# EAGLE design MainBoard (EAGLE 9.6.2)
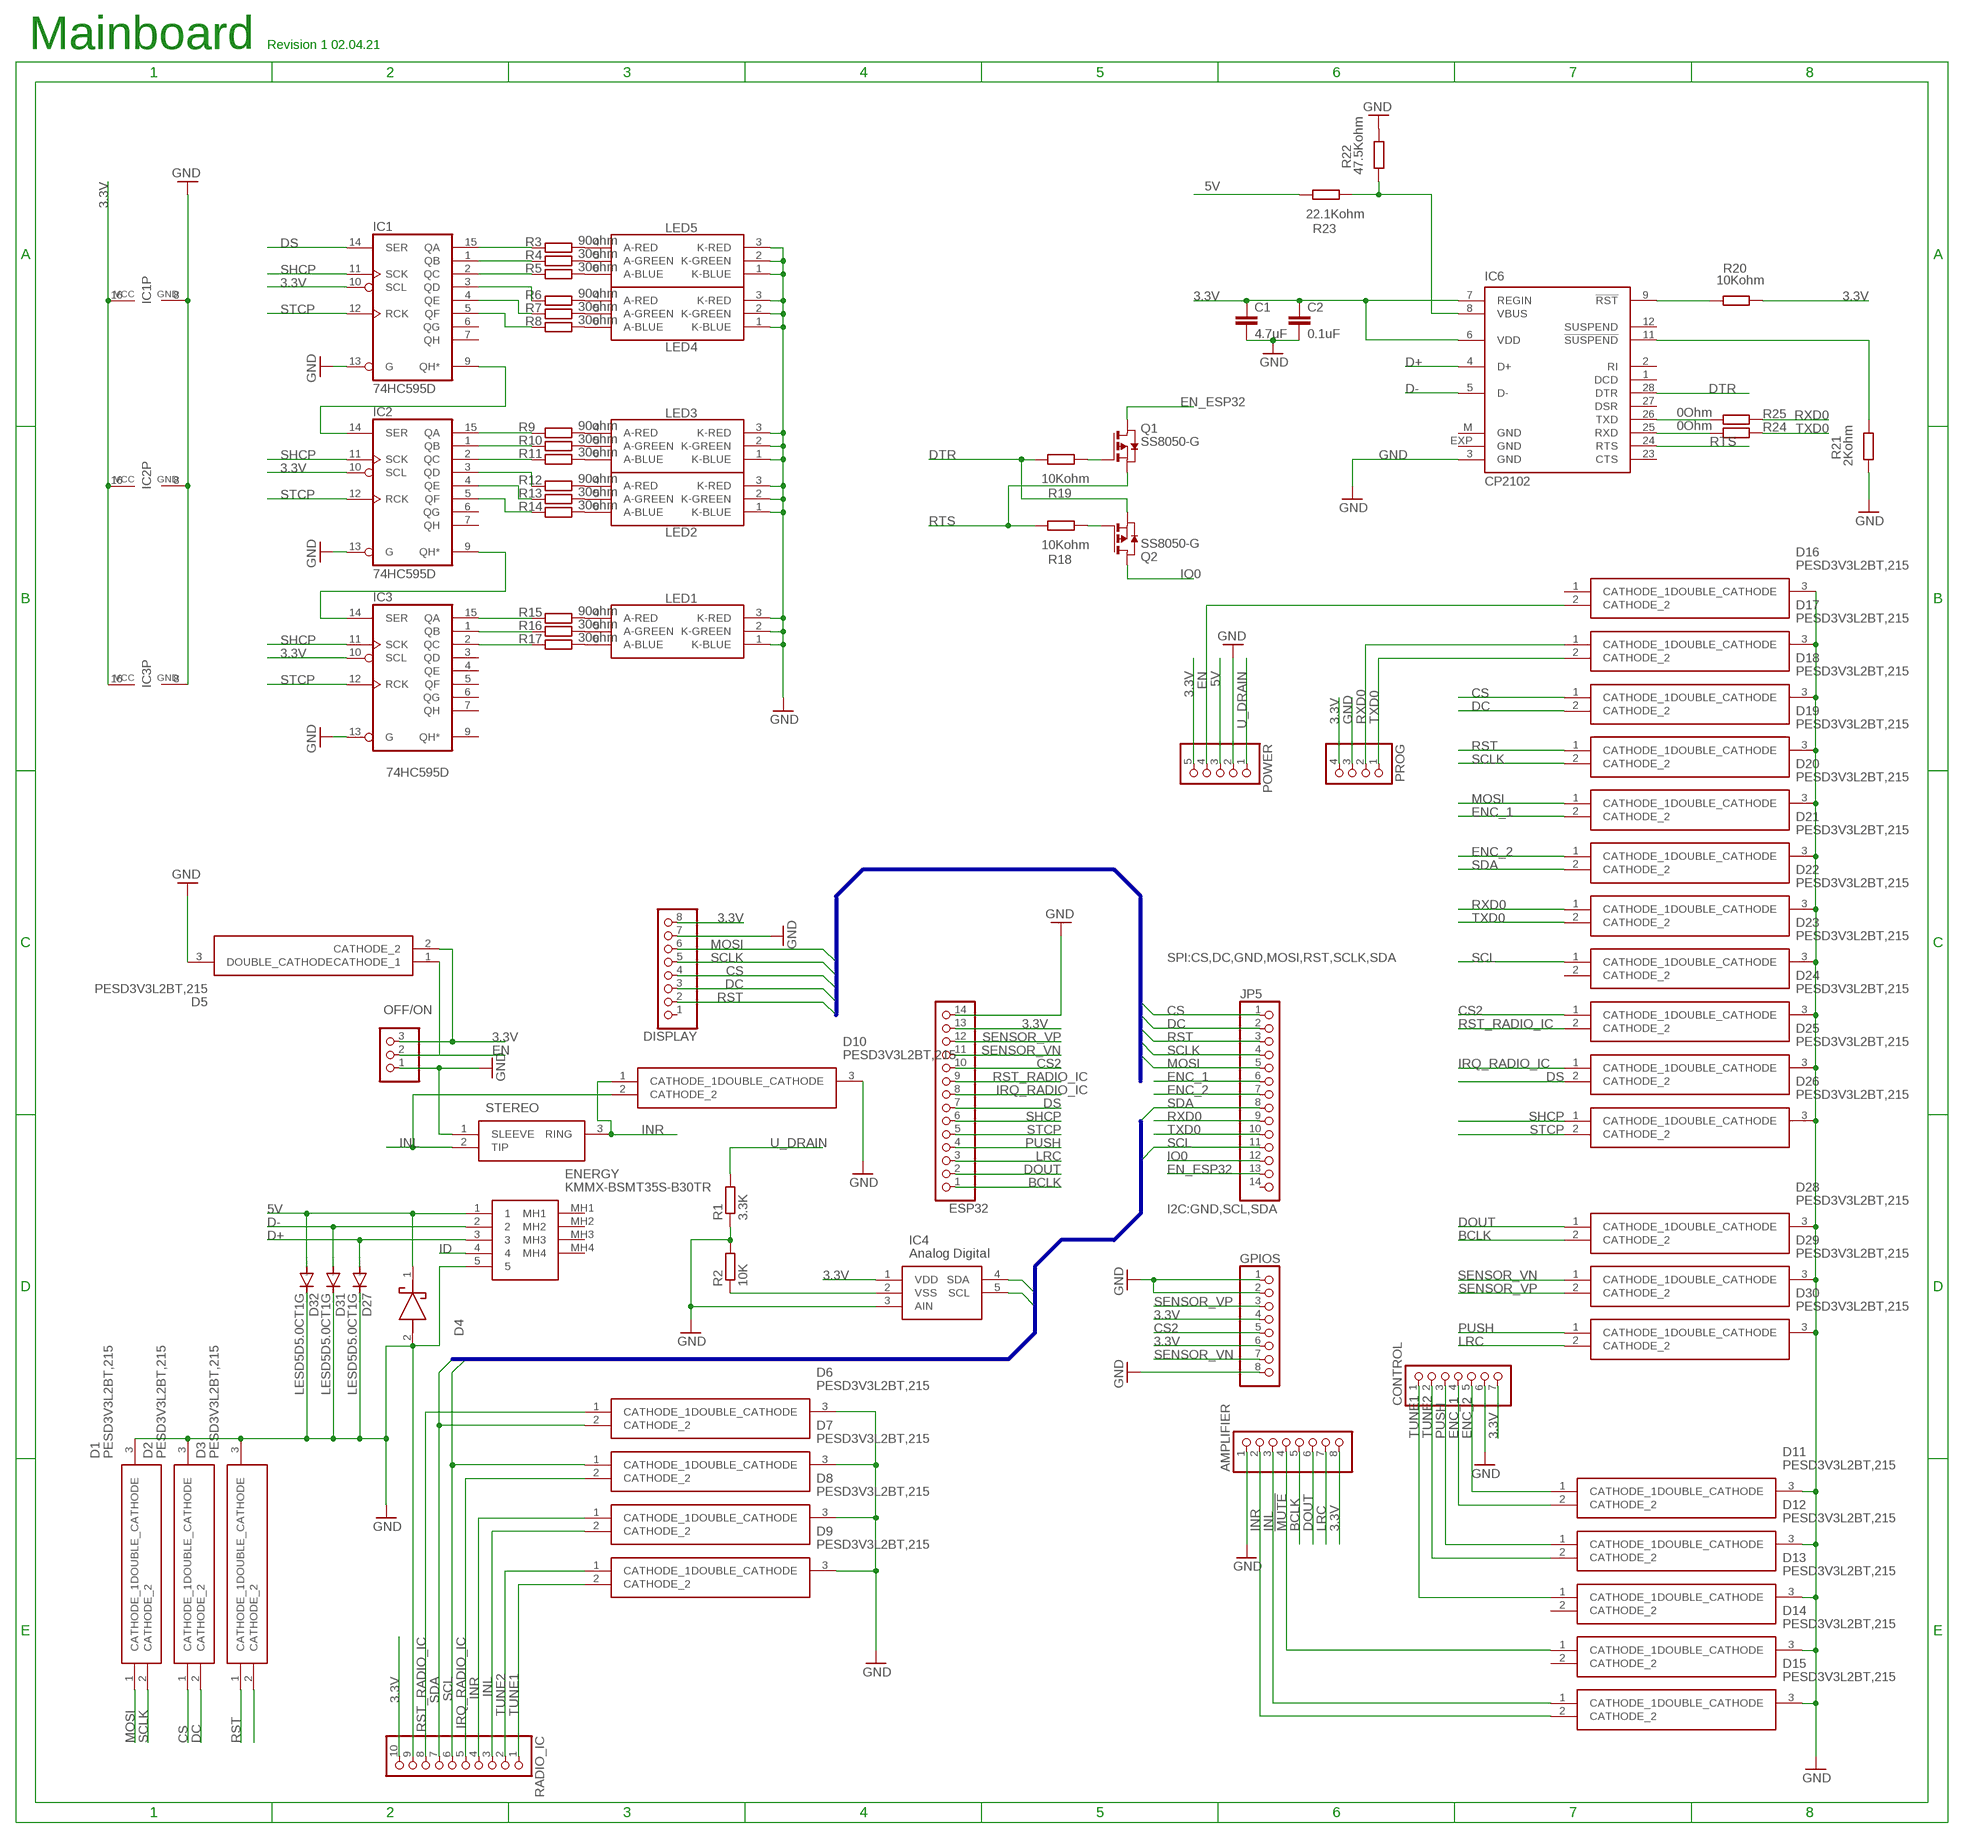
[diagram p0: schematic, sheet 1]

## Parts
AMPLIFIER  PINHD-1X8  [1X08]
C1  4.7uF  C-EUC0805  [C0805]
C2  0.1uF  C-EUC0805  [C0805]
CONTROL  PINHD-1X7  [1X07]
D1  PESD3V3L2BT,215  [SOT95P230X110-3N]
D2  PESD3V3L2BT,215  [SOT95P230X110-3N]
D3  PESD3V3L2BT,215  [SOT95P230X110-3N]
D4  LSM115JE3_TR13  [DIOM5436X330N]
D5  PESD3V3L2BT,215  [SOT95P230X110-3N]
D6  PESD3V3L2BT,215  [SOT95P230X110-3N]
D7  PESD3V3L2BT,215  [SOT95P230X110-3N]
D8  PESD3V3L2BT,215  [SOT95P230X110-3N]
D9  PESD3V3L2BT,215  [SOT95P230X110-3N]
D10  PESD3V3L2BT,215  [SOT95P230X110-3N]
D11  PESD3V3L2BT,215  [SOT95P230X110-3N]
D12  PESD3V3L2BT,215  [SOT95P230X110-3N]
D13  PESD3V3L2BT,215  [SOT95P230X110-3N]
D14  PESD3V3L2BT,215  [SOT95P230X110-3N]
D15  PESD3V3L2BT,215  [SOT95P230X110-3N]
D16  PESD3V3L2BT,215  [SOT95P230X110-3N]
D17  PESD3V3L2BT,215  [SOT95P230X110-3N]
D18  PESD3V3L2BT,215  [SOT95P230X110-3N]
D19  PESD3V3L2BT,215  [SOT95P230X110-3N]
D20  PESD3V3L2BT,215  [SOT95P230X110-3N]
D21  PESD3V3L2BT,215  [SOT95P230X110-3N]
D22  PESD3V3L2BT,215  [SOT95P230X110-3N]
D23  PESD3V3L2BT,215  [SOT95P230X110-3N]
D24  PESD3V3L2BT,215  [SOT95P230X110-3N]
D25  PESD3V3L2BT,215  [SOT95P230X110-3N]
D26  PESD3V3L2BT,215  [SOT95P230X110-3N]
D27  LESD5D5.0CT1G  DIODE-SOD523  [SOD523]
D28  PESD3V3L2BT,215  [SOT95P230X110-3N]
D29  PESD3V3L2BT,215  [SOT95P230X110-3N]
D30  PESD3V3L2BT,215  [SOT95P230X110-3N]
D31  LESD5D5.0CT1G  DIODE-SOD523  [SOD523]
D32  LESD5D5.0CT1G  DIODE-SOD523  [SOD523]
DISPLAY  PINHD-1X8  [1X08]
ENERGY  KMMX-BSMT35S-B30TR  [KMMXBSMT35SB30TR]
ESP32  PINHD-1X14  [1X14]
GPIOS  PINHD-1X8  [1X08]
IC1  74HC595D  [SO16]
IC2  74HC595D  [SO16]
IC3  74HC595D  [SO16]
IC4  Analog Digital  MCP3221A6T-E_OTVAO  [SOT95P280X145-5N]
IC6  CP2102  [MLP28]
JP5  PINHD-1X14  [1X14]
LED1  CLY6D-FKC-CK1N1D1BB7D3D3  [PLCC6]
LED2  CLY6D-FKC-CK1N1D1BB7D3D3  [PLCC6]
LED3  CLY6D-FKC-CK1N1D1BB7D3D3  [PLCC6]
LED4  CLY6D-FKC-CK1N1D1BB7D3D3  [PLCC6]
LED5  CLY6D-FKC-CK1N1D1BB7D3D3  [PLCC6]
OFF/ON  PINHD-1X3  [1X03]
POWER  PINHD-1X5  [1X05]
PROG  PINHD-1X4  [1X04]
Q1  SS8050-G  PMOSSOT23  [SOT-23]
Q2  SS8050-G  PMOSSOT23  [SOT-23]
R1  3.3K  R-EU_R0603  [R0603]
R2  10K  R-EU_R0603  [R0603]
R3  90ohm  R-EU_R0402  [R0402]
R4  30ohm  R-EU_R0402  [R0402]
R5  30ohm  R-EU_R0402  [R0402]
R6  90ohm  R-EU_R0402  [R0402]
R7  30ohm  R-EU_R0402  [R0402]
R8  30ohm  R-EU_R0402  [R0402]
R9  90ohm  R-EU_R0402  [R0402]
R10  30ohm  R-EU_R0402  [R0402]
R11  30ohm  R-EU_R0402  [R0402]
R12  90ohm  R-EU_R0402  [R0402]
R13  30ohm  R-EU_R0402  [R0402]
R14  30ohm  R-EU_R0402  [R0402]
R15  90ohm  R-EU_R0402  [R0402]
R16  30ohm  R-EU_R0402  [R0402]
R17  30ohm  R-EU_R0402  [R0402]
R18  10Kohm  R-EU_R0402  [R0402]
R19  10Kohm  R-EU_R0402  [R0402]
R20  10Kohm  R-EU_R0402  [R0402]
R21  2Kohm  R-EU_R0805  [R0805]
R22  47.5Kohm  R-EU_R0402  [R0402]
R23  22.1Kohm  R-EU_R0402  [R0402]
R24  0Ohm  R-EU_R0603  [R0603]
R25  0Ohm  R-EU_R0603  [R0603]
RADIO_IC  PINHD-1X10  [1X10]
STEREO  SJ-3523-SMT-TR  [SJ3523SMTTR]

## Nets
3.3V: AMPLIFIER.8 C1.1 C2.1 CONTROL.7 D5.2(CATHODE_2) DISPLAY.8 ESP32.13 GPIOS.4 GPIOS.6 IC1.10(SCL) IC1.16(VCC) IC2.10(SCL) IC2.16(VCC) IC3.10(SCL) IC3.16(VCC) IC4.1(VDD) IC6.6(VDD) IC6.7(REGIN) OFF/ON.3 POWER.5 PROG.4 R20.2 RADIO_IC.10
5V: D4.1(K) D32.A ENERGY.1 POWER.3 R23.1
!MUTE: AMPLIFIER.4 D14.1(CATHODE_1)
BCLK: AMPLIFIER.5 D28.2(CATHODE_2) ESP32.1
CS: D2.1(CATHODE_1) D18.1(CATHODE_1) DISPLAY.4 JP5.1
CS2: D24.1(CATHODE_1) ESP32.10 GPIOS.5
D+: D27.A ENERGY.3 IC6.4(D+)
D-: D31.A ENERGY.2 IC6.5(D-)
DC: D2.2(CATHODE_2) D18.2(CATHODE_2) DISPLAY.3 JP5.2
DOUT: AMPLIFIER.6 D28.1(CATHODE_1) ESP32.2
DS: D25.2(CATHODE_2) ESP32.7 IC1.14(SER)
DTR: IC6.28(DTR) Q2.2(S) R19.1
EN: D5.1(CATHODE_1) D16.2(CATHODE_2) OFF/ON.2 POWER.4
EN_ESP32: JP5.13 Q1.1(D)
ENC_1: CONTROL.4 D11.2(CATHODE_2) D20.2(CATHODE_2) JP5.6
ENC_2: CONTROL.5 D11.1(CATHODE_1) D21.1(CATHODE_1) JP5.7
GND: AMPLIFIER.1 C1.2 C2.2 CONTROL.6 D1.3(DOUBLE_CATHODE) D2.3(DOUBLE_CATHODE) D3.3(DOUBLE_CATHODE) D4.2(A) D5.3(DOUBLE_CATHODE) D6.3(DOUBLE_CATHODE) D7.3(DOUBLE_CATHODE) D8.3(DOUBLE_CATHODE) D9.3(DOUBLE_CATHODE) D10.3(DOUBLE_CATHODE) D11.3(DOUBLE_CATHODE) D12.3(DOUBLE_CATHODE) D13.3(DOUBLE_CATHODE) D14.3(DOUBLE_CATHODE) D15.3(DOUBLE_CATHODE) D16.3(DOUBLE_CATHODE) D17.3(DOUBLE_CATHODE) D18.3(DOUBLE_CATHODE) D19.3(DOUBLE_CATHODE) D20.3(DOUBLE_CATHODE) D21.3(DOUBLE_CATHODE) D22.3(DOUBLE_CATHODE) D23.3(DOUBLE_CATHODE) D24.3(DOUBLE_CATHODE) D25.3(DOUBLE_CATHODE) D26.3(DOUBLE_CATHODE) D27.C D28.3(DOUBLE_CATHODE) D29.3(DOUBLE_CATHODE) D30.3(DOUBLE_CATHODE) D31.C D32.C DISPLAY.7 ENERGY.5 ESP32.14 GPIOS.1 GPIOS.2 GPIOS.8 IC1.8(GND) IC1.13(G) IC2.8(GND) IC2.13(G) IC3.8(GND) IC3.13(G) IC4.3(AIN) IC6.3(GND) LED1.1(K-BLUE) LED1.2(K-GREEN) LED1.3(K-RED) LED2.1(K-BLUE) LED2.2(K-GREEN) LED2.3(K-RED) LED3.1(K-BLUE) LED3.2(K-GREEN) LED3.3(K-RED) LED4.1(K-BLUE) LED4.2(K-GREEN) LED4.3(K-RED) LED5.1(K-BLUE) LED5.2(K-GREEN) LED5.3(K-RED) OFF/ON.1 POWER.2 PROG.3 R1.1 R2.2 R21.1 R22.2 RADIO_IC.9 STEREO.1(SLEEVE)
ID: ENERGY.4
INL: AMPLIFIER.3 D8.2(CATHODE_2) D10.2(CATHODE_2) D15.1(CATHODE_1) RADIO_IC.3 STEREO.2(TIP)
INR: AMPLIFIER.2 D8.1(CATHODE_1) D10.1(CATHODE_1) D15.2(CATHODE_2) RADIO_IC.4 STEREO.3(RING)
IO0: JP5.12 Q2.1(D)
IRQ_RADIO_IC: D7.2(CATHODE_2) D25.1(CATHODE_1) ESP32.8 RADIO_IC.5
LRC: AMPLIFIER.7 D30.2(CATHODE_2) ESP32.3
MOSI: D1.1(CATHODE_1) D20.1(CATHODE_1) DISPLAY.6 JP5.5
N$1: Q2.3(G) R18.2
N$2: Q1.3(G) R19.2
N$3: LED2.4(A-RED) R12.2
N$4: LED1.4(A-RED) R15.2
N$5: D3.2(CATHODE_2)
N$6: LED2.5(A-GREEN) R13.2
N$7: LED5.4(A-RED) R3.2
N$8: LED5.5(A-GREEN) R4.2
N$9: LED5.6(A-BLUE) R5.2
N$10: LED4.4(A-RED) R6.2
N$11: LED4.5(A-GREEN) R7.2
N$12: LED4.6(A-BLUE) R8.2
N$13: LED2.6(A-BLUE) R14.2
N$14: LED3.4(A-RED) R9.2
N$15: LED3.5(A-GREEN) R10.2
N$16: LED3.6(A-BLUE) R11.2
N$17: IC1.9(QH*) IC2.14(SER)
N$18: LED1.5(A-GREEN) R16.2
N$19: LED1.6(A-BLUE) R17.2
N$20: IC3.2(QC) R17.1
N$21: IC2.9(QH*) IC3.14(SER)
N$22: IC4.2(VSS) R2.1
N$23: IC3.1(QB) R16.1
N$24: IC3.15(QA) R15.1
N$25: IC2.3(QD) R12.1
N$26: IC2.4(QE) R13.1
N$27: IC2.5(QF) R14.1
N$28: IC2.2(QC) R11.1
N$29: IC2.1(QB) R10.1
N$30: IC2.15(QA) R9.1
N$31: IC1.15(QA) R3.1
N$32: IC1.1(QB) R4.1
N$33: IC1.2(QC) R5.1
N$34: IC1.3(QD) R6.1
N$35: IC1.4(QE) R7.1
N$36: IC1.5(QF) R8.1
N$38: IC6.9(!RST) R20.1
N$43: IC6.11(!SUSPEND) R21.2
N$44: IC6.8(VBUS) R22.1 R23.2
N$45 [other]: IC6.26(TXD) R24.1
N$46 [other]: IC6.25(RXD) R25.1
PUSH: CONTROL.3 D12.1(CATHODE_1) D30.1(CATHODE_1) ESP32.4
RST: D3.1(CATHODE_1) D19.1(CATHODE_1) DISPLAY.2 JP5.3
RST_RADIO_IC: D6.1(CATHODE_1) D24.2(CATHODE_2) ESP32.9 RADIO_IC.8
RTS: IC6.24(RTS) Q1.2(S) R18.1
RXD0 [other]: D17.1(CATHODE_1) D22.1(CATHODE_1) JP5.9 PROG.2 R24.2
SCL: D7.1(CATHODE_1) D23.1(CATHODE_1) IC4.5(SCL) JP5.11 RADIO_IC.6
SCLK: D1.2(CATHODE_2) D19.2(CATHODE_2) DISPLAY.5 JP5.4
SDA: D6.2(CATHODE_2) D21.2(CATHODE_2) IC4.4(SDA) JP5.8 RADIO_IC.7
SENSOR_VN: D29.1(CATHODE_1) ESP32.11 GPIOS.7
SENSOR_VP: D29.2(CATHODE_2) ESP32.12 GPIOS.3
SHCP: D26.1(CATHODE_1) ESP32.6 IC1.11(SCK) IC2.11(SCK) IC3.11(SCK)
STCP: D26.2(CATHODE_2) ESP32.5 IC1.12(RCK) IC2.12(RCK) IC3.12(RCK)
TUNE1: CONTROL.1 D9.2(CATHODE_2) D13.1(CATHODE_1) RADIO_IC.1
TUNE2: CONTROL.2 D9.1(CATHODE_1) D12.2(CATHODE_2) RADIO_IC.2
TXD0 [other]: D17.2(CATHODE_2) D22.2(CATHODE_2) JP5.10 PROG.1 R25.2
U_DRAIN: POWER.1 R1.2
Unconnected: D13.2(CATHODE_2) D14.2(CATHODE_2) D16.1(CATHODE_1) D23.2(CATHODE_2) DISPLAY.1 ENERGY.MH1 ENERGY.MH2 ENERGY.MH3 ENERGY.MH4 IC1.6(QG) IC1.7(QH) IC2.6(QG) IC2.7(QH) IC3.3(QD) IC3.4(QE) IC3.5(QF) IC3.6(QG) IC3.7(QH) IC3.9(QH*) IC6.1(DCD) IC6.2(RI) IC6.12(SUSPEND) IC6.23(CTS) IC6.27(DSR) JP5.14

## Buses
SPI:CS,DC,GND,MOSI,RST,SCLK,SDA
I2C:GND,SCL,SDA

## Notes on the sheet
- Mainboard | Revision 1 02.04.21

## Power pins joined to a net without a drawn wire
GND: IC6.EXP(GND) IC6.M(GND)

## Library data of the parts
AMPLIFIER DISPLAY GPIOS = pinhead:PINHD-1X8: PIN HEADER
C1 C2 = rcl:C-EU: CAPACITOR, European symbol; SPICEPREFIX: C
CONTROL = pinhead:PINHD-1X7: PIN HEADER
D1-D3 D5-D26 D28-D30 = MouserUseful:PESD3V3L2BT,215: ESD Suppressors / TVS Diodes Source: Datasheet <https://assets.nexperia.com/documents/data-sheet/PESDXL2BT_SER.pdf>; DESCRIPTION: ESD Suppressors / TVS Diodes; HEIGHT: 1.1mm; MANUFACTURER_NAME: Nexperia; MANUFACTURER_PART_NUMBER: PESD3V3L2BT,215; MOUSER_PART_NUMBER: 771-PESD3V3L2BT-T/R; MOUSER_PRICE-STOCK: https://www.mouser.co.uk/ProductDetail/Nexperia/PESD3V3L2BT215?qs=LOCUfHb8d9sJv74jXvbOZw%3D%3D
D4 = CommonParts:LSM115JE3_TR13: Schottky Diodes & Rectifiers Schottky Source: Datasheet <https://componentsearchengine.com/Datasheets/1/LSM115JE3_TR13.pdf>; DESCRIPTION: Schottky Diodes & Rectifiers Schottky; HEIGHT: 3.3mm; MANUFACTURER_NAME: Microsemi Corporation; MANUFACTURER_PART_NUMBER: LSM115JE3/TR13; MOUSER_PART_NUMBER: 494-LSM115JE3/TR13; MOUSER_PRICE-STOCK: https://www.mouser.com/Search/Refine.aspx?Keyword=494-LSM115JE3%2FTR13
D27 D31 D32 = diode:DIODE-: DIODE
ENERGY = MouserUseful:KMMX-BSMT35S-B30TR: CONN RCPT USB MICRO B SMD RA Source: Datasheet <http://www.kycon.com/Pub_Eng_Draw/KMMX-BSMT35S-BTR.pdf>; DESCRIPTION: CONN RCPT USB MICRO B SMD RA; HEIGHT: 2.18mm; MANUFACTURER_NAME: Kycon, Inc.; MANUFACTURER_PART_NUMBER: KMMX-BSMT35S-B30TR
ESP32 JP5 = pinhead:PINHD-1X14: PIN HEADER
IC1-IC3 = NixieTube:74*595: 8-bit SHIFT REGISTER, output latch
IC4 = MouserUseful:MCP3221A6T-E_OTVAO: Analog to Digital Converters - ADC Automotive, 12-bit SAR ADC, I2C, single channel Source: Datasheet <https://www.arrow.com/en/products/mcp3221a6t-eotvao/microchip-technology>; DESCRIPTION: Analog to Digital Converters - ADC Automotive, 12-bit SAR ADC, I2C, single channel; HEIGHT: 1.45mm; MANUFACTURER_NAME: Microchip; MANUFACTURER_PART_NUMBER: MCP3221A6T-E/OTVAO; MOUSER_PART_NUMBER: 579-MCP3221A6TEOTVAO; MOUSER_PRICE-STOCK: https://www.mouser.co.uk/ProductDetail/Microchip-Technology/MCP3221A6T-E-OTVAO?qs=5aG0NVq1C4xIe7K3D%2FHE6g%3D%3D
IC6 = silabs:CP210*: Single-Chip USB to UART Bridge Source: www.silabs.com .. CP2101.pdf / cp2102.pdf; MF: FARNELL; MPN: CP2102-GM; OC_FARNELL: 9282130; OC_NEWARK: 30K5635
LED1-LED5 = MouserUseful:CLY6D-FKC-CK1N1D1BB7D3D3: LED Blue/Green/Red 6-Pin PLCC T/R Cree CLY6D-FKC-CK1N1D1BB7D3D3, CLY6D-FKC Series RGB LED, 480 (Blue) nm, 540 (Green) nm, 624 (Red) nm PLCC 6 Source: Datasheet <http://www.cree.com/led-components/media/documents/ds-1321-CLY6D-FKC.pdf>; DESCRIPTION: LED Blue/Green/Red 6-Pin PLCC T/R Cree CLY6D-FKC-CK1N1D1BB7D3D3, CLY6D-FKC Series RGB LED, 480 (Blue) nm, 540 (Green) nm, 624 (Red) nm PLCC 6; HEIGHT: mm; MANUFACTURER_NAME: Cree, Inc.; MANUFACTURER_PART_NUMBER: CLY6D-FKC-CK1N1D1BB7D3D3; MOUSER_PART_NUMBER: 941-CLY6DFKCCK1N1D1B; MOUSER_PRICE-STOCK: https://www.mouser.co.uk/ProductDetail/Cree-Inc/CLY6D-FKC-CK1N1D1BB7D3D3?qs=3ZbGupGMFUcwV8ee%2FC0TnQ%3D%3D
OFF/ON = pinhead:PINHD-1X3: PIN HEADER
POWER = pinhead:PINHD-1X5: PIN HEADER
PROG = pinhead:PINHD-1X4: PIN HEADER
Q1 Q2 = zetex:PMOSSOT23: MOS FET; OC_FARNELL: unknown; OC_NEWARK: unknown
R1-R25 = rcl:R-EU_: RESISTOR, European symbol; SPICEPREFIX: R
RADIO_IC = pinhead:PINHD-1X10: PIN HEADER
STEREO = MouserUseful:SJ-3523-SMT-TR: Phone Connectors Audio Jacks Source: Datasheet <https://www.mouser.de/datasheet/2/670/sj_352x_smt-1779397.pdf>; DESCRIPTION: Phone Connectors Audio Jacks; HEIGHT: 5.2mm; MANUFACTURER_NAME: CUI Devices; MANUFACTURER_PART_NUMBER: SJ-3523-SMT-TR; MOUSER_PART_NUMBER: 490-SJ-3523-SMT-TR; MOUSER_PRICE-STOCK: https://www.mouser.co.uk/ProductDetail/CUI-Devices/SJ-3523-SMT-TR?qs=WyjlAZoYn51zOHzJ3r4ZRA%3D%3D

## Net classes
1 other: width 0.152 mm, drill 0.1 mm, clearance 0.205 mm to class 0, clearance 0.205 mm

## Board
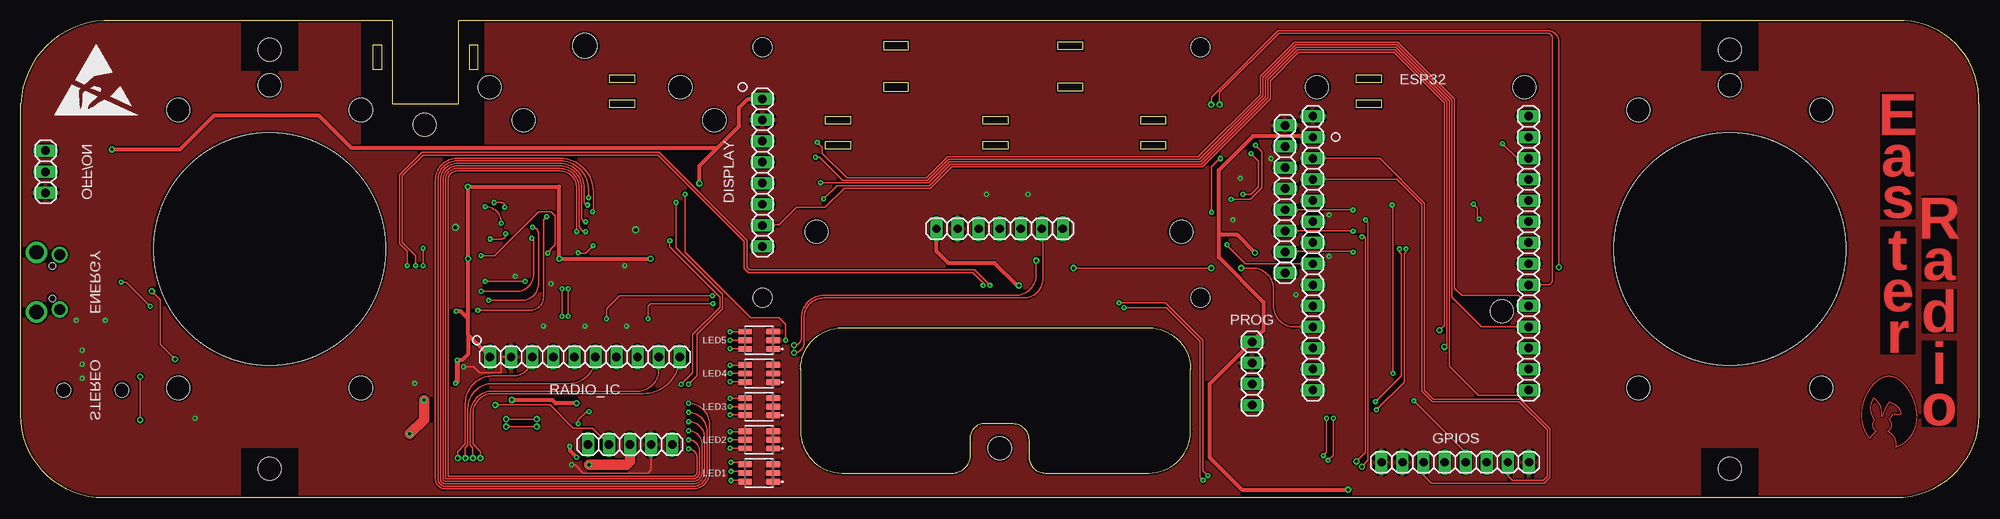
[diagram p1: board, top side]
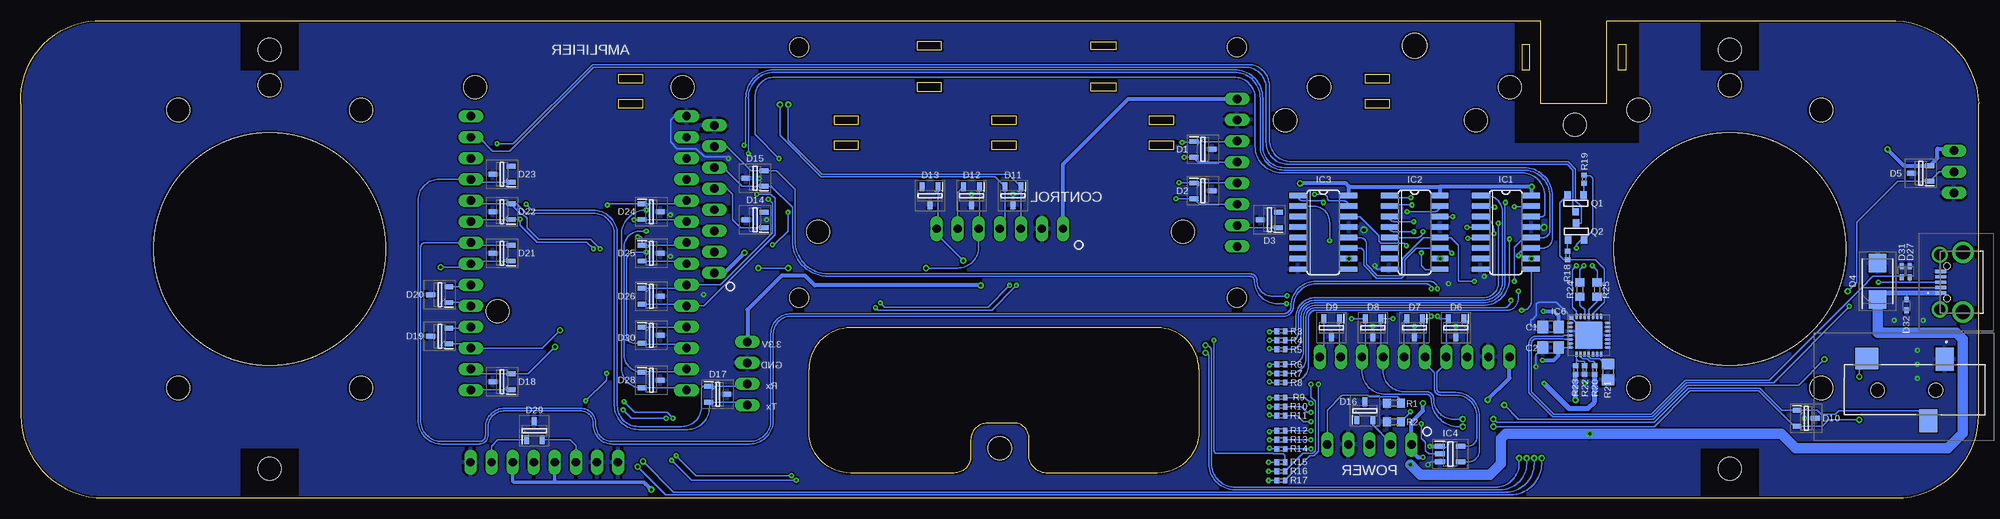
[diagram p2: board, bottom side, seen from below]

Size 236.01 x 57.5 mm. Coordinates in mm from the lower left corner, seen from the top.
Outline: 236,47.5 236,10 arc-90 226,0 10,0 arc-90 0,10 0,47.5 arc-90 11,57.5 44.8,57.5 44.8,47.5 52.8,47.5 52.8,57.5 227,57.5 arc-90 236,47.5
Outline: 94,15.5 94,8 arc90 99,3 112,3 arc90 114.5,5 114.5,7 arc-90 116,9 119.5,9 arc-90 121.5,7 121.5,5 arc90 123.5,3 136,3 arc90 141,8 141,15.5 arc90 136,20.5 99,20.5 arc90 94,15.5
Outline: 104,55 104,54 107,54 107,55 104,55
Outline: 104,50 104,49 107,49 107,50 104,50
Outline: 125,55 128,55 128,54 125,54 125,55
Outline: 125,50 128,50 128,49 125,49 125,50
Outline: 97,46 100,46 100,45 97,45 97,46
Outline: 97,43 100,43 100,42 97,42 97,43
Outline: 135,46 138,46 138,45 135,45 135,46
Outline: 135,43 138,43 138,42 135,42 135,43
Outline: 116,46 119,46 119,45 116,45 116,46
Outline: 116,43 119,43 119,42 116,42 116,43
Outline: 71,51 74,51 74,50 71,50 71,51
Outline: 71,48 74,48 74,47 71,47 71,48
Outline: 161,51 164,51 164,50 161,50 161,51
Outline: 161,48 164,48 164,47 161,47 161,48
Outline: 54.1,51.6 54.1,54.6 55.1,54.6 55.1,51.6 54.1,51.6
Outline: 42.5,51.6 42.5,54.6 43.5,54.6 43.5,51.6 42.5,51.6
Copper layers (1*16): Top 0.035mm / dielectric 1.5mm / Bottom 0.035mm
Design rules "default *": minimum track width 6mil, minimum drill 0.2mm, track to track 6mil, track to pad 6mil, pad to pad 6mil, via to via 6mil, smd to smd 6mil, copper to edge 10mil, drill to drill 6mil, minimum pad ring 10mil, minimum via ring 8mil, stop-mask expansion 4mil, vias tented up to drill 0mil, thermal gap 10mil
Holes 2.8 mm at 118,6 181.25,49.5 156.25,49.5 56.5,49.5 79.5,49.5 83.6,45.5 60.6,45.5 178.5,22.5 95.9,32.1 139.9,32.1 206,3.5 30,3.5 217,46.75 195,46.75 217,13.25 195,13.25 30,54 206,54 41,46.75 19,46.75 41,13.25 19,13.25 48.7,44.95 30,49.75 206,49.75
Holes 28 mm at 206,30 30,30
Holes 2.3 mm at 89.4,54.3 89.4,24.1 142.2,24.1 142.2,54.3
Holes 3 mm at 68,54.5

### Footprints (pad centres in the part's own frame; a part is rotated, then mirrored left to right if it is on the bottom)
1X08 = drill 1.016 long: 1 -8.89,0; 2 -6.35,0; 3 -3.81,0; 4 -1.27,0; 5 1.27,0; 6 3.81,0; 7 6.35,0; 8 8.89,0
C0805 = smd 1.3 x 1.5: 1 -0.95,0; 2 0.95,0
1X07 = drill 1.016 long: 1 -7.62,0; 2 -5.08,0; 3 -2.54,0; 4 0,0; 5 2.54,0; 6 5.08,0; 7 7.62,0
SOT95P230X110-3N = smd 1.05 x 0.6: 1 -1.1,0.95; 2 -1.1,-0.95; 3 1.1,0
DIOM5436X330N = smd 2.2 x 2.15: 1 -2.2,0; 2 2.2,0
SOD523 = smd 0.7 x 0.5: A 0.7,0; C -0.6,0
KMMXBSMT35SB30TR = smd 0.4 x 1.35: 1 -1.3,2.675; 2 -0.65,2.675; 3 0,2.675; 4 0.65,2.675; 5 1.3,2.675 | drill 1.724 pad 2.586: MH1 -3.6,0; MH2 3.6,0 | drill 1.312 pad 1.969: MH3 -3.3,2.8; MH4 3.3,2.8 | hole 0.8: -1.95,1.9; 1.95,1.9
1X14 = drill 1.016 long: 1 -16.51,0; 2 -13.97,0; 3 -11.43,0; 4 -8.89,0; 5 -6.35,0; 6 -3.81,0; 7 -1.27,0; 8 1.27,0; 9 3.81,0; 10 6.35,0; 11 8.89,0; 12 11.43,0; 13 13.97,0; 14 16.51,0
SO16 = smd 0.66 x 2.032: 1 -4.445,-3.073; 2 -3.175,-3.073; 3 -1.905,-3.073; 4 -0.635,-3.073; 5 0.635,-3.073; 6 1.905,-3.073; 7 3.175,-3.073; 8 4.445,-3.073; 9 4.445,3.073; 10 3.175,3.073; 11 1.905,3.073; 12 0.635,3.073; 13 -0.635,3.073; 14 -1.905,3.073; 15 -3.175,3.073; 16 -4.445,3.073
SOT95P280X145-5N = smd 1.2 x 0.6: 1 -1.25,0.95; 2 -1.25,0; 3 -1.25,-0.95; 4 1.25,-0.95; 5 1.25,0.95
MLP28 = smd 0.6 x 0.3: 1 -2.3,1.5; 2 -2.3,1; 3 -2.3,0.5; 4 -2.3,0; 5 -2.3,-0.5; 6 -2.3,-1; 7 -2.3,-1.5; 15 2.3,-1.5; 16 2.3,-1; 17 2.3,-0.5; 18 2.3,0; 19 2.3,0.5; 20 2.3,1; 21 2.3,1.5 | smd 0.3 x 0.6: 8 -1.5,-2.3; 9 -1,-2.3; 10 -0.5,-2.3; 11 0,-2.3; 12 0.5,-2.3; 13 1,-2.3; 14 1.5,-2.3; 22 1.5,2.3; 23 1,2.3; 24 0.5,2.3; 25 0,2.3; 26 -0.5,2.3; 27 -1,2.3; 28 -1.5,2.3 | smd 3.3 x 3.3: EXP 0,0 | smd 0.435 x 0.435: M -2.103,2.103
PLCC6 = smd 1.6 x 0.7: 1 -1.7,1.05; 2 -1.7,0; 3 -1.7,-1.05; 4 1.7,-1.05; 5 1.7,0; 6 1.7,1.05
1X03 = drill 1.016 long: 1 -2.54,0; 2 0,0; 3 2.54,0
1X05 = drill 1.016 long: 1 -5.08,0; 2 -2.54,0; 3 0,0; 4 2.54,0; 5 5.08,0
1X04 = drill 1.016 long: 1 -3.81,0; 2 -1.27,0; 3 1.27,0; 4 3.81,0
SOT-23 = smd 0.787 x 0.889: 1 0.025,-1.016; 2 -0.94,1.016; 3 0.991,1.016
R0603 = smd 1 x 1.1: 1 -0.85,0; 2 0.85,0
R0402 = smd 0.6 x 0.7: 1 -0.5,0; 2 0.5,0
R0805 = smd 1.3 x 1.5: 1 -0.95,0; 2 0.95,0
1X10 = drill 1.016 long: 1 -11.43,0; 2 -8.89,0; 3 -6.35,0; 4 -3.81,0; 5 -1.27,0; 6 1.27,0; 7 3.81,0; 8 6.35,0; 9 8.89,0; 10 11.43,0
SJ3523SMTTR = smd 2.2 x 2.8: 1 2.4,-3.7; 3 4.4,3.7 | smd 2.8 x 2.6: 2 11.8,-3.8 | hole 1.7: 3.5,0; 10.5,0

### Placement (x,y rotation side)
AMPLIFIER  152.4,36 270 top
C1  51.6,20.6 180 bottom
C2  51.6,18.1 180 bottom
CONTROL  118,32.44 180 top
D1  93.5,42 0 bottom
D2  93.5,37 0 bottom
D3  85.5,33.5 180 bottom
D4  12.2,26.1 90 bottom
D5  7,39.1 180 bottom
D6  63,20.5 270 bottom
D7  68,20.5 270 bottom
D8  73,20.5 270 bottom
D9  78,20.5 270 bottom
D10  20.8,9.6 0 bottom
D11  116.4,36.4 270 bottom
D12  121.4,36.4 270 bottom
D13  126.4,36.4 270 bottom
D14  147.5,33.5 180 bottom
D15  147.5,38.5 180 bottom
D16  74,10.5 90 bottom
D17  152,12.5 0 bottom
D18  178,14 180 bottom
D19  185.5,19.5 180 bottom
D20  185.5,24.5 180 bottom
D21  178,29.5 180 bottom
D22  178,34.5 180 bottom
D23  178,39 180 bottom
D24  160,34.5 0 bottom
D25  160,29.5 0 bottom
D26  160,24.3 0 bottom
D27  8.3,27.3 270 bottom
D28  160,14.2 0 bottom
D29  174.1,8.1 90 bottom
D30  160,19.6 0 bottom
D31  9.3,27.3 270 bottom
D32  8.7,23.2 90 bottom
DISPLAY  89.4,39.2 90 top
ENERGY  1.9,26 90 bottom
ESP32  155.75,29.49 90 top
GPIOS  172.9,4.3 0 top
IC1  57,32 270 bottom
IC2  68,32 270 bottom
IC3  79,32 270 bottom
IC4  63.7,5.3 0 bottom
IC6  47,19.6 0 bottom
JP5  181.75,29.49 90 top
LED1  89,3 180 top
LED2  89,7 180 top
LED3  89,11 180 top
LED4  89,15 180 top
LED5  89,19 180 top
OFF/ON  3,39.3 90 top
POWER  73.44,6.44 180 top
PROG  148.41,15 90 top
Q1  48.6,35.5 0 bottom
Q2  48.5,32.1 180 bottom
R1  70.5,11.4 0 bottom
R2  70.5,9.2 180 bottom
R3  84.1,20.1 180 bottom
R4  84.1,19 180 bottom
R5  84.1,17.9 180 bottom
R6  84.1,16.1 180 bottom
R7  84.1,15 180 bottom
R8  84.1,13.9 180 bottom
R9  84.1,12.1 180 bottom
R10  84.1,11 180 bottom
R11  84.1,9.9 180 bottom
R12  84.1,8.1 180 bottom
R13  84.1,7 180 bottom
R14  84.1,5.9 180 bottom
R15  84.1,4.3 180 bottom
R16  84.1,3.2 180 bottom
R17  84.1,2.1 180 bottom
R18  49.56,29.2 90 bottom
R19  47.56,38.4 270 bottom
R20  46.3,15.4 270 bottom
R21  44.7,15.2 90 bottom
R22  47.5,15.4 270 bottom
R23  48.6,15.4 90 bottom
R24  48.1,25.1 90 bottom
R25  46,25.1 90 bottom
RADIO_IC  68,17 180 top
STEREO  1.7,13 180 bottom
U$1  [ESD_10.00]  4,46 0 top

### Tracks (layer width: path | path; a pad name or v marks a point on that pad's centre or on a via)
3.3V  (via drill 0.2, 0.35)
  Top 0.508: v67,11.4 64.5,11.4 64.1,11.8 v59.21,11.8 v59.2,11.81 | RADIO_IC.10 53.9,19.67 | 53.9,19.67 53.9,21.6 | 53.9,21.6 53.9,28.8 | 53.9,28.8 v53.9,37.5 64.9,37.5 64.9,28.85 IC2.10 IC3.10 | v81.8,37.9 81.8,40 84,42.2 | 86.6,47 86.6,44.8 84,42.2 | 86.6,47 86.6,47.09 | v120.3,25.6 120.1,25.6 117.4,28.3 111.8,28.3 110.38,29.72 CONTROL.7 | 144.4,31.7 144.4,29 149.8,23.6 149.8,20.2 PROG.4 143.3,13.7 143.3,4.9 147.2,1 v160,1 | 144.4,31.7 144.4,39.5 148.5,43.6 155.61,43.6 ESP32.13 | IC1.10 53.9,28.8 | v11,42 19.2,42 23.3,46.1 35.9,46.1 39.8,42.2 84,42.2 | v148.77,29.54 146.62,31.68 144.41,31.68 144.4,31.7 | v67,4.9 66.2,5.7 66.2,6.2 v66.17,6.2 | 86.6,47 87.69,48.09 DISPLAY.8 | 53.9,19.67 53.9,17.3 53.2,16.6 v52.6,16.6 | 53.9,21.6 53,22.5 v52.5,22.5
  Top 0.61: v52.6,16.6 52.6,14 v52.4,13.8
  Bottom 0.152: C2.1 IC6.7 IC6.6
  Bottom 0.406: 160.7,1.7 160.9,1.9 171.4,1.9 | GPIOS.4 171.63,2.13 171.4,1.9 | 171.4,1.9 176.6,1.9 176.71,2.01 GPIOS.6
  Bottom 0.508: v67,11.4 67,10.5 68.36,9.14 POWER.5 68.36,5.66 67.6,4.9 v67,4.9 | v59.2,11.81 56.57,14.44 RADIO_IC.10 | IC1.16 53.93,37.47 v53.9,37.5 64.9,37.5 | 75.9,37.5 64.9,37.5 | IC3.16 75.9,36.47 75.9,37.5 | IC2.16 64.9,36.47 64.9,37.5 | 75.9,37.5 76.3,37.9 v81.8,37.9 | v120.3,25.6 140.3,25.6 141.5,26.8 144.3,26.8 148.41,22.69 PROG.4 | v160,1 160.7,1.7 | v11,42 9.05,40.05 D5.2 5,40.95 5,42.1 3.26,42.1 OFF/ON.3 | CONTROL.7 110.38,40.22 102.51,48.09 DISPLAY.8 | v66.17,6.2 65,6.2 IC4.1 | v52.6,16.6 51.2,16.6 50.65,17.15 C2.1 | v52.5,22.5 51.2,22.5 50.65,21.95 C1.1 | v148.77,29.54 151.2,27.11 AMPLIFIER.8
  Bottom 0.61: v52.4,13.8 49.4,10.8 47.1,10.8 46.3,11.6 R20.2
  other vias: 64.93,28.82 75.93,28.82 53.93,28.82
5V  (via drill 0.35)
  Top 1.27: POWER.3 73.44,4.44 73,4 v68.5,4 | v46.9,7.73 48.6,9.43 v48.6,11.8
  Bottom 0.152: D32.A 8.7,24.7
  Bottom 0.61: ENERGY.1 8.7,24.7 11.4,24.7 D4.1 | v48.6,11.8 R23.1
  Bottom 1.27: v68.5,4 67.3,2.8 58.9,2.8 57.6,4.1 57.6,7.13 57,7.73 v46.9,7.73 23.83,7.73 22.07,5.97 3.73,5.97 1.9,7.8 1.9,19.1 2.7,19.9 12.2,19.9 D4.1
!MUTE
  Bottom 0.152: D14.1 148.85,32.55 149.25,32.55 150.2,33.5 150.2,36.6 150.87,37.27 AMPLIFIER.4
BCLK  (via drill 0.2)
  Top 0.152: AMPLIFIER.5 160.56,34.73 v160.6,34.69
  Bottom 0.152: ESP32.1 156.05,13.28 161.07,13.28 D28.2 arc90 163.61,15.76 163.61,31.68 arc90 v160.6,34.69
CS  (via drill 0.2)
  Top 0.152: 181.68,13.05 JP5.1 181.17,12.4 175.7,12.4 172.21,15.89 172.21,47.85 165.75,54.31 153.77,54.31 150.01,50.55 150.01,48.35 142.17,40.51 111.97,40.51 109.41,37.95 96.45,37.95 v96.4,38 | 89.42,37.95 DISPLAY.4
  Bottom 0.152: D18.1 181.68,13.05 JP5.1 | v96.4,38 96.35,37.95 D2.1 89.42,37.95 DISPLAY.4
CS2  (via drill 0.2)
  Top 0.152: 156.14,35.45 ESP32.10 | v165.3,35.3 arc-90 165.4,35.2 v165.4,15 | v167.9,11.7 174.17,5.43 GPIOS.5
  Bottom 0.152: ESP32.10 156.14,35.45 D24.1 165.15,35.45 arc-90 v165.3,35.3 | v165.4,15 165.4,14.2 v167.9,11.7
D+  (via drill 0.2)
  Top 0.152: v15.6,23.1 12.7,26 v12.1,26
  Bottom 0.152: IC6.4 50,19.6 50.1,19.5 53.3,19.5 arc-90 54.2,18.6 54.2,12.67 51.34,9.8 39.33,9.8 35.23,13.9 24.73,13.9 15.6,23.03 v15.6,23.1 | 12,26 v12.1,26 8.3,26 | 4.67,26.1 ENERGY.3 8.3,26 | D27.A 8.3,26
D-
  Bottom 0.152: IC6.5 50,19.1 50.1,19.2 53.3,19.2 arc-90 53.9,18.6 53.9,12.8 51.21,10.11 39.45,10.11 35.35,14.21 25.25,14.21 14.11,25.35 | 14.11,25.35 ENERGY.2 | D31.A 9.4,26.7 12.76,26.7 14.11,25.35
DC  (via drill 0.2 pad 0.3, 0.35)
  Top 0.152: 181.18,14.95 JP5.2 | v96.78,36.05 98.37,37.65 109.54,37.65 112.1,40.2 142.3,40.2 150.31,48.22 150.31,50.43 153.89,54.01 165.63,54.01 171.91,47.73 171.91,18.5 v171.6,18.2
  Bottom 0.152: v96.78,36.05 D2.2 93.94,35.39 DISPLAY.3 | v171.6,18.2 174.8,15 174.85,14.95 D18.2 181.18,14.95 JP5.2
DOUT  (via drill 0.2)
  Top 0.152: AMPLIFIER.6 160.56,32.19 v160.6,32.15
  Bottom 0.152: ESP32.2 156.07,15.2 161.05,15.2 D28.1 arc90 163.31,17.36 163.31,29.45 arc-90 163.3,29.45 163.3,30.2 arc90 161.35,32.15 v160.6,32.15
DS  (via drill 0.2 pad 0.3)
  Top 0.152: ESP32.7 147.64,28.22 145.4,30.46 v145.4,30.5 | v143.54,34.4 143.54,39.94 144.5,40.9 v144.6,40.9
  Bottom 0.152: IC1.14 52.61,33.91 arc-90 52.3,34.21 52.3,36.36 arc-90 55.14,39.2 84.06,39.2 arc90 87.21,42.35 87.21,48.16 arc-90 89.75,50.7 145.16,50.7 arc-90 147.5,48.36 147.5,43.8 v144.6,40.9 | D25.2 156.08,28.55 ESP32.7 | v145.4,30.5 145.2,30.5 143.54,32.16 v143.54,34.4
DTR  (via drill 0.2)
  Top 0.152: v48.5,30.1 v48.5,28
  Bottom 0.152: IC6.28 48.5,22.5 49,23 49,27.5 v48.5,28 | R19.1 47.46,38.8 46.8,38.8 46.5,38.5 46.5,32.18 47.6,31.08 | v48.5,30.1 48.5,30.5 47.92,31.08 47.6,31.08 | 47.6,31.08 Q2.2
EN  (via drill 0.35)
  Top 0.152: v57.2,11.2 63.8,11.2 66.6,8.4 68.94,8.4 POWER.4 | v15.8,24.9 16.8,23.9 16.8,18.5 v18.6,16.7
  Bottom 0.152: OFF/ON.2 4.75,39.3 D5.1 9.75,38.15 14.7,33.2 14.7,26 v15.8,24.9 | v57.2,11.2 55.5,9.5 39.2,9.5 35.1,13.6 21.7,13.6 v18.6,16.7 | D16.2 73.05,8.8 70.9,6.65 POWER.4
EN_ESP32
  Bottom 0.152: Q1.1 48.91,34.48 48.91,39.5 49.6,40.2 83.26,40.2 arc90 85.9,42.84 85.9,49.38 arc-90 88.44,51.92 166.98,51.92 177.1,41.8 179.1,41.8 180.76,43.46 JP5.13
ENC_1  (via drill 0.35)
  Top 0.152: v144.5,47.4 144.5,48.87 151.65,56.01 184.05,56.01 arc-90 184.6,55.45 184.6,26.22 arc-90 184.06,25.68 JP5.6
  Bottom 0.152: D20.2 181.98,25.45 JP5.6 | v144.5,47.4 144.5,46.93 144.5,43.67 139.54,38.71 118.56,38.71 D11.2 117.35,33.09 CONTROL.4
ENC_2  (via drill 0.35)
  Top 0.152: v143.49,47.4 143.49,48.29 151.52,56.31 184.05,56.31 arc-90 185.41,54.95 185.41,27.81 v185.39,27.8 | CONTROL.5
  Bottom 0.152: v143.49,47.4 v143.5,47.39 143.5,43.1 139.41,39.01 116.96,39.01 D11.1 CONTROL.5 | v185.39,27.8 181.67,27.8 181.75,27.88 JP5.7 181.42,28.55 D21.1
GND  (via drill 0.2, 0.45)
  Top 0.152: v53.37,15.8 54.6,15.8 55.3,15.1 57.9,15.1 57.9,16.9 58,17 RADIO_IC.9 | v66.4,4 66.8,4 67.8,3 75.6,3 76,3.4 76,6.42 POWER.2
  Bottom 0.152: IC2.8 72.36,27.55 arc90 v72.8,28 | R2.2 71.2,9.2 | IC6.3 48.4,20.1 | 48.4,20.1 arc-90 48.3,20.2 48.3,20.7 arc90 48.2,20.8 IC6.M 49.6,22.2 49.6,22.3 50.9,23.6 53.1,23.6 53.3,23.4 53.3,22 53.8,21.5 53.9,21.5 54,21.4 54,20.7 53.9,20.6 C1.2 | 48.4,20.1 47.5,20.1 IC6.EXP | C2.2 53.4,17.25 53.4,15.83 v53.37,15.8 | v150.7,40.9 150.9,41.1 153.6,41.1 154.6,42.1 156.9,42.1 157.7,42.9 157.7,45.5 157.2,46 ESP32.14 | IC4.3 66.05,4.35 v66.4,4
  other vias: 74.1,32.3 52.4,32.6 59.6,26.7 68,20.7 63,20.7 73,20.7 63.9,25.8 21,9.6 121.4,36.6 116.4,36.6 146.1,33.5 147,38.5 47.5,13.8 7.4,14.4 7.4,16.1 7.4,17.8 10.2,21.4 6.7,21.4 153.7,24.5 157.7,34.1 157.7,29.1
  pour Top: -0.1,57.5 26.25,57.5 26.25,51.25 33.75,51.25 33.75,57.5 40.75,57.5 40.75,42.5 56.15,42.5 56.15,57.5 202.25,57.5 202.25,51.25 209.75,51.25 209.75,57.5 236.25,57.5 236.25,0 209.75,0 209.75,6.25 202.25,6.25 202.25,-0.1 33.75,-0.1 33.75,6.25 26.25,6.25 26.25,0 -0.1,0
  pour Bottom: -0.2,57.5 26.25,57.5 26.25,51.25 33.75,51.25 33.75,57.5 40.75,57.5 40.75,42.5 56.15,42.5 56.15,57.6 202.25,57.6 202.25,51.25 209.75,51.25 209.75,57.5 236.25,57.5 236.25,0 209.75,0 209.75,6.25 202.25,6.25 202.25,-0.1 33.75,-0.1 33.75,6.25 26.25,6.25 26.25,-0.2 -0.2,-0.2
INL  (via drill 0.2 pad 0.3, 0.35)
  Top 0.152: v62.2,8.59 v58.5,8.59 | v83.43,23.42 75.92,23.42 75.6,23.1 v75.6,21.6 | v14.4,9.4 v14.4,14.6
  Bottom 0.152: 73.95,21.5 D8.2 73.95,21.7 | 73.95,21.5 73.95,17.4 RADIO_IC.3 74.35,15.34 arc-90 71.5,12.49 66.59,12.49 arc90 66,11.9 arc-90 62.69,8.59 v62.2,8.59 | STEREO.2 13.9,16.8 14.4,16.3 v14.4,14.6 | v58.5,8.59 39.12,8.59 34.81,12.9 26.5,12.9 22.25,8.65 D10.2 18.85,8.65 18.1,9.4 v14.4,9.4 | v83.43,23.42 83.43,23.4 84.5,23.4 arc90 87.31,26.2 arc-90 87.81,26.7 138.66,26.7 arc90 143,31.05 143,35.01 145.55,37.55 D15.1 149.05,37.55 151.31,39.81 AMPLIFIER.3 | v75.6,21.6 74.05,21.6 73.95,21.5
INR  (via drill 0.2 pad 0.3, 0.35)
  Top 0.152: v62.2,9.5 v58.5,9.5 | v83.37,24.37 72.17,24.37 70.6,22.8 v70.6,21.6
  Bottom 0.152: STEREO.3 7.3,10.5 16.9,10.5 17.3,10.1 19,10.1 19.45,10.55 D10.1 23.72,10.55 26.37,13.21 35,13.21 39.1,9.1 58.1,9.1 v58.5,9.5 | v62.2,9.5 63.3,9.5 arc90 65.69,11.9 arc-90 66.59,12.8 69.27,12.8 arc90 71.81,15.34 RADIO_IC.4 72.05,17.24 D8.1 v70.6,21.6 | v83.37,24.37 83.43,24.3 85.11,24.3 arc90 87,26.2 arc-90 87.81,27 138.66,27 arc90 142.7,31.05 142.7,37.2 144.9,39.4 146.35,39.4 D15.2 146.45,39.4 148,39.4 150.95,42.35 AMPLIFIER.2
IO0  (via drill 0.2)
  Top 0.152: JP5.12 180.38,40.92 v178.6,42.7
  Bottom 0.152: Q2.1 47.9,33.12 47.9,35.13 48.6,35.83 48.6,39.63 49.48,40.51 82.86,40.51 arc90 85.5,43.15 85.5,49.68 arc-90 88.04,52.22 167.11,52.22 176.63,42.7 v178.6,42.7
IRQ_RADIO_IC  (via drill 0.2 pad 0.3, 0.35)
  Top 0.152: 156.06,30.45 ESP32.8 | RADIO_IC.5 arc-90 66.06,13.79 56.9,13.79 arc90 53.89,10.78 53.89,6.37 53.59,6.07 v53.59,4.8 | v161,4.4 162.1,5.5 162.1,31.3 161.95,31.45 v161.65,31.45
  Bottom 0.152: v53.59,4.8 53.59,4.14 arc90 57.04,0.69 157.29,0.69 v161,4.4 | ESP32.8 156.06,30.45 D25.1 161.1,31.3 161.25,31.45 v161.65,31.45 | D7.2 69.27,21.28 RADIO_IC.5
LRC  (via drill 0.2)
  Top 0.152: v160.6,29.61 160.5,29.71 152.46,29.71 AMPLIFIER.7
  Bottom 0.152: ESP32.3 156.19,18.5 160.95,18.5 D30.2 162.05,18.65 arc90 163,19.6 163,28.6 arc90 161.99,29.61 v160.6,29.61
MOSI  (via drill 0.2 pad 0.3)
  Top 0.152: 89.46,42.95 DISPLAY.6 | v96.01,42.85 96.61,42.25 96.61,41.55 99.6,38.56 109.16,38.56 111.72,41.12 141.92,41.12 149.4,48.6 149.4,50.8 153.51,54.92 166,54.92 172.82,48.1 172.82,25.28 173.7,24.4 180.49,24.4 JP5.5
  Bottom 0.152: D20.1 182.16,23.55 JP5.5 | v96.01,42.85 94.7,42.85 D1.1 89.46,42.95 DISPLAY.6
N$1
  Bottom 0.152: R18.2 49.56,31.07 49.51,31.07 Q2.3
N$2
  Bottom 0.152: R19.2 47.61,37.85 Q1.3
N$3  (via drill 0.2 pad 0.3)
  Top 0.152: v85.5,8 87.25,8 LED2.4
  Bottom 0.152: R12.2 85.4,8.1 v85.5,8
N$4  (via drill 0.2 pad 0.3)
  Top 0.152: v85.6,4.3 87.05,4.3 LED1.4
  Bottom 0.152: R15.2 v85.6,4.3
N$6  (via drill 0.2 pad 0.3)
  Top 0.152: v85.5,7 LED2.5
  Bottom 0.152: R13.2 v85.5,7
N$7  (via drill 0.2 pad 0.3)
  Top 0.152: v85.5,20 87.25,20 LED5.4
  Bottom 0.152: R3.2 85.4,20.1 v85.5,20
N$8  (via drill 0.2 pad 0.3)
  Top 0.152: v85.5,19 LED5.5
  Bottom 0.152: R4.2 v85.5,19
N$9  (via drill 0.2 pad 0.3)
  Top 0.152: v85.5,18 87.25,18 LED5.6
  Bottom 0.152: R5.2 85.4,17.9 v85.5,18
N$10  (via drill 0.2 pad 0.3)
  Top 0.152: v85.5,16 87.25,16 LED4.4
  Bottom 0.152: R6.2 85.4,16.1 v85.5,16
N$11  (via drill 0.2 pad 0.3)
  Top 0.152: v85.5,15 LED4.5
  Bottom 0.152: R7.2 v85.5,15
N$12  (via drill 0.2 pad 0.3)
  Top 0.152: v85.5,14 87.25,14 LED4.6
  Bottom 0.152: R8.2 85.4,13.9 v85.5,14
N$13  (via drill 0.2 pad 0.3)
  Top 0.152: v85.5,6 87.25,6 LED2.6
  Bottom 0.152: R14.2 85.4,5.9 v85.5,6
N$14  (via drill 0.2 pad 0.3)
  Top 0.152: v85.5,12 87.25,12 LED3.4
  Bottom 0.152: R9.2 85.4,12.1 v85.5,12
N$15  (via drill 0.2 pad 0.3)
  Top 0.152: v85.5,11 LED3.5
  Bottom 0.152: R10.2 v85.5,11
N$16  (via drill 0.2 pad 0.3)
  Top 0.152: v85.5,10 87.25,10 LED3.6
  Bottom 0.152: R11.2 85.4,9.9 v85.5,10
N$17  (via drill 0.2 pad 0.3)
  Top 0.152: v55.1,22.6 61.4,22.6 arc90 63,24.2 63,33.5 v63.4,33.9
  Bottom 0.152: 53.87,27.5 arc90 IC1.9 53.93,23.67 arc90 55,22.6 v55.1,22.6 | v63.4,33.9 IC2.14 | IC2.14 arc90 IC2.14 arc-90 IC2.14
N$18  (via drill 0.2 pad 0.3)
  Top 0.152: v85.6,3.2 87.1,3.2 LED1.5
  Bottom 0.152: R16.2 v85.6,3.2
N$19  (via drill 0.2 pad 0.3)
  Top 0.152: v85.6,2.1 87.15,2.1 LED1.6
  Bottom 0.152: R17.2 v85.6,2.1
N$20  (via drill 0.2 pad 0.3)
  Top 0.152: v79.6,13.7 81,15.1 81,19.7 84.3,23 84.3,24.19 78.24,30.25 v78.24,31
  Bottom 0.152: R17.1 80.64,5.06 80.15,5.06 79.6,5.62 v79.6,13.7 | IC3.2 80.24,35.17 arc90 78.24,33.17 v78.24,31
N$21  (via drill 0.2 pad 0.3)
  Top 0.152: v69,30.4 68.1,29.5 67.2,29.5 v67.2,29.54
  Bottom 0.152: IC3.14 74.61,33.91 73.19,32.48 73.1,32.4 72.32,31.62 72.32,30.94 72.08,30.7 69.3,30.7 v69,30.4 | IC2.9 64.98,27.5 66.7,27.5 67.2,28 v67.2,29.54
N$22  (via drill 0.2)
  Top 0.152: v68.5,10.39 68.19,10.39 67.2,9.4 v67.2,8.93
  Bottom 0.152: R2.1 68.5,10.35 v68.5,10.39 | v67.2,8.93 67.2,7.2 66.7,6.7 66.7,5.7 66.3,5.3 IC4.2
N$23  (via drill 0.2 pad 0.3)
  Top 0.152: v80.5,13.7 81.5,14.7 81.5,19.7 84.61,22.8 84.61,24.53 79,30.14 v79,35.6
  Bottom 0.152: v80.5,13.7 80.5,12.15 79.97,11.62 79.97,5.68 80.28,5.37 81.43,5.37 R16.1 | v79,35.6 arc-90 79.19,35.8 81.43,35.8 arc90 IC3.1
N$24  (via drill 0.2 pad 0.3)
  Top 0.152: v92.2,19 92.2,20.9 91.4,21.7 87.96,21.7 80.05,29.61 v80.05,36.6
  Bottom 0.152: R15.1 83.6,5.1 83.8,5.3 83.8,5.32 85,5.32 85.07,5.4 92,5.4 92.19,5.6 92.19,17.84 92.2,17.84 v92.2,19 | IC3.15 arc-90 76.55,35.8 78.2,35.8 arc90 78.5,36.1 arc-90 79,36.6 v80.05,36.6
N$25  (via drill 0.2 pad 0.3)
  Top 0.152: v80.5,8.1 arc-90 82.11,6.49 82.11,3.1 arc-90 81,1.99 51.2,1.99 arc-90 50.89,2.3 50.89,38.3 arc-90 52.6,40.01 65,40.01 arc-90 67.61,37.4 67.61,33.79 arc90 v68.1,33.3
  Bottom 0.152: R12.1 v80.5,8.1 | IC2.3 arc-90 70.47,33.3 v68.1,33.3
N$26  (via drill 0.2 pad 0.3)
  Top 0.152: v80.5,7 arc-90 81.81,5.7 81.81,3.1 arc-90 81,2.29 51.2,2.29 arc-90 51.2,2.3 51.2,38.3 arc-90 52.6,39.7 65,39.7 arc-90 67.31,37.4 67.31,32.9 arc90 v68.1,32.1
  Bottom 0.152: R13.1 v80.5,7 | v68.1,32.1 70.54,32.1 arc90 IC2.4
N$27  (via drill 0.2 pad 0.3)
  Top 0.152: v80.5,5.9 arc-90 81.5,4.9 81.5,3.1 arc-90 81,2.6 51.5,2.6 51.5,38.3 arc-90 52.6,39.4 65,39.4 arc-90 67,37.4 v67,32.1
  Bottom 0.152: R14.1 v80.5,5.9 | IC2.5 67.73,31.36 arc-90 v67,32.1
N$28  (via drill 0.2 pad 0.3)
  Top 0.152: v80.5,9.2 arc-90 82.41,7.29 82.41,3.1 arc-90 81,1.69 51.2,1.69 arc-90 50.59,2.3 50.59,38.3 arc-90 52.6,40.31 65,40.31 arc-90 67.91,37.4 67.91,35.69 arc90 v68.3,35.3
  Bottom 0.152: R11.1 82.11,9.9 81.41,9.2 v80.5,9.2 | v68.3,35.3 70.95,35.3 arc-90 IC2.2
N$29  (via drill 0.2 pad 0.3)
  Top 0.152: v80.5,10.3 arc-90 82.72,8.08 82.72,3.1 arc-90 81,1.38 51.2,1.38 arc-90 50.28,2.3 50.28,38.3 arc-90 52.6,40.62 65,40.62 arc-90 68.42,37.2 68.42,36.2 v68.45,36.2
  Bottom 0.152: R10.1 81.66,11 80.96,10.3 v80.5,10.3 | v68.45,36.2 70.83,36.2 arc90 IC2.1
N$30  (via drill 0.2 pad 0.3)
  Top 0.152: v80.5,11.4 arc-90 83.02,8.88 83.02,3.1 arc-90 81,1.08 51.2,1.08 arc-90 49.98,2.3 49.98,38.3 arc-90 52.6,40.92 65,40.92 arc-90 69.02,36.9 69.02,34.62 arc-90 v68.9,34.5
  Bottom 0.152: v80.5,11.4 81.2,12.1 R9.1 | IC2.15 arc90 65.6,34.5 v68.9,34.5
N$31  (via drill 0.2 pad 0.3)
  Top 0.152: v57.93,33.1 57.93,33.17 arc90 v56,35.1
  Bottom 0.152: R3.1 82.94,20.1 arc-90 82.3,20.75 82.3,21.8 arc90 79.98,24.12 59.7,24.12 arc-90 57.9,25.92 57.9,33.07 arc-90 v57.93,33.1 | v56,35.1 54,35.1 arc-90 IC1.15
N$32
  Bottom 0.152: R4.1 82.94,19 arc-90 82,19.95 82,21.8 arc90 79.98,23.82 59.7,23.82 arc-90 57.4,26.12 57.4,34.45 arc-90 59.4,36.45 IC1.1
N$33  (via drill 0.2 pad 0.3)
  Top 0.152: v57.06,35.6 57.9,35.6 arc-90 58.4,35.1 arc-90 v58.35,35.05
  Bottom 0.152: R5.1 82.94,17.9 arc-90 81.69,19.16 81.69,21.8 arc90 79.98,23.51 59.7,23.51 arc-90 57.09,26.12 57.09,35.57 arc90 v57.06,35.6 | v58.35,35.05 59.95,35.05 arc90 IC1.2
N$34  (via drill 0.2 pad 0.3)
  Top 0.152: v56.56,31.2 57.9,31.2 arc90 58.5,31.8 arc90 v58.45,31.85
  Bottom 0.152: R6.1 82.94,16.1 arc-90 81.39,17.66 81.39,21.8 arc90 79.98,23.21 59.7,23.21 arc-90 56.59,26.32 56.59,31.17 arc90 v56.56,31.2 | v58.45,31.85 58.45,32.28 arc-90 IC1.3
N$35  (via drill 0.2 pad 0.3)
  Top 0.152: v56.4,23.8 60.4,23.8 arc90 62.4,25.8 62.4,31.9 arc90 v61.7,32.6
  Bottom 0.152: R7.1 82.94,15 arc-90 81.08,16.86 81.08,21.8 arc90 79.98,22.91 59.8,22.91 59.7,22.91 57.3,22.91 arc-90 v56.4,23.8 | v61.7,32.6 60.11,32.6 arc-90 IC1.4
N$36  (via drill 0.2 pad 0.3)
  Top 0.152: v55.5,24.9 59.8,24.9 arc90 61.8,26.9 61.8,31.3 v61.6,31.3
  Bottom 0.152: R8.1 82.94,13.9 arc-90 80.78,16.07 80.78,21.8 arc90 79.98,22.6 56.9,22.6 arc-90 55.5,24 v55.5,24.9 | v61.6,31.3 60.14,31.3 arc-90 IC1.5
N$38
  Bottom 0.152: R20.1 46.3,16.3 46.47,16.47 46.87,16.47 47.18,16.77 47.75,16.77 48,17.03 IC6.9
N$43
  Bottom 0.152: R21.2 45.05,16.15 45.67,16.77 46.75,16.77 47,17.03 IC6.11
N$44
  Bottom 0.152: R22.1 47.5,16.37 47.6,16.47 48.27,16.47 48.5,16.7 | IC6.8 48.5,16.7 | R23.2 48.5,16 48.5,16.7
N$45
  Bottom 0.152: IC6.26 47.5,22.65 48.1,23.25 R24.1
N$46
  Bottom 0.152: IC6.25 47,22.7 46,23.7 R25.1
PUSH  (via drill 0.35)
  Top 0.152: 155.8,20.55 ESP32.4 153.54,20.6 arc-90 151,23.14 151,25.16 arc90 148.46,27.7 v147.1,27.7 | 120.45,32.53 CONTROL.3 | v143.5,27.7 v126.9,27.7
  Bottom 0.152: v147.1,27.7 v143.5,27.7 | v126.9,27.7 123.08,27.7 arc-90 120.54,30.24 CONTROL.3 120.45,32.53 D12.1 | D30.1 155.8,20.55 ESP32.4
RST  (via drill 0.35)
  Top 0.152: v171,20.2 171.6,20.8 171.6,47.6 165.5,53.7 154.02,53.7 150.62,50.3 150.62,48.09 142.42,39.9 112.22,39.9 109.67,37.34 99.3,37.34 96.96,35 93.5,35 91.4,32.9 | 89.1,32.55 89.38,32.83 DISPLAY.2 89.45,32.9 91.4,32.9 | 91.35,32.85 91.4,32.9
  Bottom 0.152: D19.1 182.24,18.55 JP5.3 173.14,18.06 v171,20.2 | D3.1 89.1,32.55 DISPLAY.2
RST_RADIO_IC  (via drill 0.2 pad 0.3, 0.35)
  Top 0.152: 156,33.55 ESP32.9 | RADIO_IC.8 arc-90 59.35,14.7 56.9,14.7 arc90 53.59,11.39 53.59,6.5 52.68,5.59 v52.68,4.8 | v161.64,3.76 162.41,4.52 162.41,33.2 v162.1,33.5
  Bottom 0.152: D6.1 61.65,21.2 RADIO_IC.8 | v52.68,4.8 52.68,4.14 arc90 56.43,0.39 158.27,0.39 v161.64,3.76 | ESP32.9 156,33.55 D24.2 161.15,33.5 v162.1,33.5
RTS
  Bottom 0.152: IC6.24 46.5,22.2 45.1,23.6 45.1,27.6 46.2,28.7 R18.1 50,28.7 50.5,29.2 50.5,35.56 Q1.2
RXD0  (via drill 0.2, 0.2 pad 0.3)
  Top 0.152: 148.69,13.45 PROG.2 | v175.1,35.4 175.6,34.9 175.6,33.6 v175.8,33.6 | v47.6,28 47.6,29.2 46,30.8 46,38.8 48.51,41.31 76.79,41.31 87.2,30.9 87.2,27.65 87.71,27.14 114.8,27.14 116,25.94 v116,25.6 | v132.97,22.93 138.07,22.93 142.14,18.86 142.14,2.51 v142.53,2.13 | v157.57,4.53 158.21,5.16 v158.21,9.6 | v163.4,10.6 163.41,10.6 166.76,13.94 166.76,29.4 166.98,29.63 v166.98,30
  Bottom 0.152: 176.63,33.55 176.8,33.55 | 176.8,33.55 D22.1 181.5,33.55 JP5.9 | v175.1,35.4 174.36,34.66 167,34.66 arc90 164.1,31.76 164.1,11.14 arc-90 161.56,8.6 156.36,8.6 arc-90 153.94,11.01 153.94,13.26 153.75,13.45 D17.1 148.69,13.45 PROG.2 | 176.8,33.55 176.75,33.6 v175.8,33.6 175.8,32.85 173.75,30.8 167.78,30.8 v166.98,30 | v116,25.6 116.23,25.37 116.23,25.36 118.94,22.64 132.69,22.64 v132.97,22.93 | v142.53,2.13 142.85,2.13 142.86,2.12 155.16,2.12 v157.57,4.53 | v163.4,10.6 162.4,9.6 v158.21,9.6 | v47.6,28 48.1,27.5 R24.2
SCL  (via drill 0.2 pad 0.3)
  Top 0.152: v66,25.2 v66,21.9
  Bottom 0.152: IC4.5 61.55,6.25 arc-90 60.5,7.29 60.5,9.86 arc-90 63.04,12.4 64.9,12.4 arc90 65.6,13.11 65.6,15.11 66.73,16.24 RADIO_IC.6 | D23.1 181.42,38.05 JP5.11 arc-90 181.77,38.4 185.56,38.4 arc-90 188.1,35.86 188.1,9.34 arc-90 185.26,6.5 180.7,6.5 arc-90 179.69,7.5 179.69,8.5 arc90 177.69,10.5 168.5,10.5 arc90 167,9 167,8.8 arc-90 164.69,6.5 148.15,6.5 arc-90 145.3,9.34 145.3,19.76 arc90 143.16,21.9 83.8,21.9 arc-90 82.59,23.1 arc90 79.89,25.8 66.6,25.8 arc90 v66,25.2 | v66,21.9 arc90 66.3,21.6 D7.1 66.85,21.4 66.85,17.6 66.73,17.48 RADIO_IC.6 | RADIO_IC.6 66.73,17.08
SCLK  (via drill 0.2 pad 0.3)
  Top 0.152: v95.78,41.05 96.28,41.05 99.07,38.26 109.29,38.26 111.84,40.81 142.04,40.81 149.71,48.47 149.71,50.68 153.64,54.61 165.88,54.61 172.51,47.98 172.51,24.16 176.07,20.6 JP5.4
  Bottom 0.152: D19.2 181.9,20.45 JP5.4 | D1.2 94.7,41.05 | 94.7,41.05 v95.78,41.05 | DISPLAY.5 94.12,40.47 94.7,41.05
SDA  (via drill 0.2 pad 0.3)
  Top 0.152: v65.24,25.2 v65.24,21.9
  Bottom 0.152: IC4.4 61.55,4.35 arc-90 60.2,5.7 60.2,9.86 arc-90 63.04,12.71 64.9,12.71 arc90 65.3,13.11 65.3,15.13 64.19,16.24 RADIO_IC.7 arc-90 64.15,17.04 64.15,21.4 D6.2 64.94,21.6 arc90 v65.24,21.9 | 187.8,30.2 187.8,9.34 arc-90 185.26,6.8 180.7,6.8 arc-90 180,7.5 180,8.5 arc90 177.69,10.8 168.5,10.8 arc90 166.69,9 166.69,8.8 arc-90 164.69,6.8 148.15,6.8 arc-90 145.6,9.34 145.6,19.76 arc90 143.16,22.2 83.8,22.2 arc-90 82.9,23.1 arc90 79.89,26.11 66.15,26.11 arc90 v65.24,25.2 | 187.8,30.2 187.8,30.4 | 187.8,30.2 arc90 187.24,30.76 JP5.8 181.44,30.45 D21.2
SENSOR_VN
  Top 0.152: ESP32.11 155.77,38.4 165.9,38.4 168.9,35.41 168.9,12.88 170.17,11.6 180.6,11.6 184,8.2 184,2.6 183.5,2.1 179.8,2.1 179.25,2.65 GPIOS.7
  Bottom 0.152: GPIOS.7 179.25,6.25 178.5,7 D29.1
SENSOR_VP
  Top 0.152: ESP32.12 155.76,40.91 163.83,40.91 169.2,35.53 169.2,13.01 170.3,11.9 180.73,11.9 184.31,8.33 184.31,2.47 183.63,1.79 170,1.79 169.09,2.71 GPIOS.3
  Bottom 0.152: GPIOS.3 169.09,6.29 169.8,7 D29.2
SHCP  (via drill 0.2, 0.2 pad 0.3)
  Top 0.152: 155.98,25.45 ESP32.6 | v55.47,29.2 57.1,29.2 62.4,34.5 63.9,34.5 64.4,34 64.4,30.5 63.85,29.95 | 63.85,29.95 63.8,29.9 | 63.85,29.95 63.85,29.82 v63.53,29.5 | v148.83,42.5 148.8,42.5 149.6,41.7 149.6,37.4 148.2,36 v145.9,36
  Bottom 0.152: IC3.11 74.61,30.09 arc90 74.1,29.59 74.1,28.01 72.58,26.5 69.57,26.5 69.19,26.87 69.19,28.67 67.77,30.09 IC2.11 64.13,30.09 v63.53,29.5 | v55.47,29.2 55.47,29.43 54.8,30.09 IC1.11 52.61,30.09 arc-90 51.39,31.32 51.39,36.36 arc-90 54.84,39.81 83.76,39.81 arc90 86.3,42.35 86.3,48.16 arc-90 89.75,51.61 145.16,51.61 arc-90 148.61,48.16 148.61,42.72 v148.83,42.5 | D26.1 156.18,25.25 ESP32.6 151.65,25.68 145.41,31.93 145.41,35.51 v145.9,36
STCP  (via drill 0.2 pad 0.3)
  Top 0.152: v56,26.1 v60.8,26.1 | v147.3,36.6 148.3,36.6 149.2,37.5 149.2,40.6 v148.3,41.5
  Bottom 0.152: IC2.12 63.61,31.36 62.7,30.46 62.7,26.1 v60.8,26.1 | IC3.12 74.61,31.36 arc90 73.8,30.55 73.8,28.14 72.45,26.8 69.7,26.8 69.5,27 69.5,28.8 66.94,31.36 IC2.12 | 65.15,31.36 IC2.12 | v56,26.1 56,30.2 54.84,31.36 IC1.12 52.61,31.36 arc-90 51.69,32.28 51.69,36.36 arc-90 54.84,39.51 83.76,39.51 arc90 86.61,42.35 86.61,48.16 arc-90 89.75,51.31 145.16,51.31 arc-90 148.31,48.16 148.3,48.15 v148.3,41.5 | D26.2 155.96,23.35 ESP32.5 153.66,23.14 145.1,31.7 145.1,36.1 145.6,36.6 v147.3,36.6
TUNE1  (via drill 0.35)
  Top 0.152: RADIO_IC.1 arc-90 75,12.57 56.9,12.57 arc90 54.5,10.17 54.5,6.5 55.41,5.59 v55.41,4.8 | v93.2,18.41 arc90 94.1,19.31 94.1,21.7 arc-90 96.81,24.41 119.86,24.41 arc90 122.4,26.95 v122.4,28.6 | 125.45,32.61 CONTROL.1
  Bottom 0.152: D9.2 78.93,19.38 78.93,17.5 arc90 RADIO_IC.1 | v55.41,4.8 55.41,4.14 arc90 58.25,1.3 89.66,1.3 arc90 92.5,4.14 92.5,17.71 arc-90 v93.2,18.41 | 125.62,32.4 125.62,31.82 v122.4,28.6 | 125.62,32.4 CONTROL.1 | D13.1 125.45,32.57 125.62,32.4
TUNE2  (via drill 0.35)
  Top 0.152: 77.05,17.16 RADIO_IC.2 | RADIO_IC.2 | v54.5,4.8 54.5,6.07 54.2,6.37 54.2,10.17 arc-90 56.9,12.87 74.36,12.87 arc90 76.89,15.41 RADIO_IC.2 | v93.2,17.5 arc90 94.41,18.7 94.41,21.7 arc-90 96.81,24.1 120.91,24.1 arc90 123.2,26.4 123.2,32.35 123.1,32.46 | 123.1,34 123.1,32.46 | 123.1,32.46 CONTROL.2
  Bottom 0.152: D9.1 77.05,17.16 arc90 RADIO_IC.2 | v54.5,4.8 54.5,4.14 arc90 57.64,0.99 89.66,0.99 arc90 92.81,4.14 92.81,17.11 arc-90 v93.2,17.5 | D12.2 123.08,36.77 CONTROL.2
TXD0  (via drill 0.2)
  Top 0.152: 148.77,11.55 PROG.1 | v46.6,28 46.6,29.7 45.64,30.66 45.64,38.95 48.36,41.66 76.94,41.66 87.56,31.05 87.56,27.8 87.86,27.5 114.95,27.5 116.58,25.86 116.58,25.83 v116.81,25.6 | v132.4,23.5 132.72,23.5 132.73,23.51 138,23.51 142.5,19 142.5,3.3 v143.1,2.7 | v157,5.1 157.4,5.5 v157.4,9.6 | v163.3,11.61 166.4,14.71 166.4,29.4 166.17,29.63 v166.17,30
  Bottom 0.152: 176.7,35.45 176.25,35.45 175.1,34.3 167,34.3 arc90 164.46,31.76 164.46,11.14 arc-90 161.56,8.24 155.66,8.24 arc-90 153,10.9 153,11.55 | 176.7,35.45 D22.2 181.36,35.45 JP5.10 | D17.2 153,11.55 | 153,11.55 148.77,11.55 PROG.1 | v116.81,25.6 119.41,23 131.9,23 v132.4,23.5 | v143.1,2.7 154.6,2.7 v157,5.1 | v157.4,9.6 157.63,9.83 157.63,9.84 158.1,10.31 162,10.31 v163.3,11.61 | v166.17,30 166.4,30.23 166.4,30.24 167.31,31.16 173.6,31.16 175,32.56 175,33.7 175.48,34.18 175.7,34.18 176.7,35.18 176.7,35.45 | v46.6,28 46,27.4 R25.2
U_DRAIN
  Bottom 0.152: 69.65,11.25 R1.2 69.65,11.74 70.1,12.19 73.44,12.19 73.61,12.35 76.75,12.35 78.52,10.58 POWER.1
(copper drawn outside any net)
  shapes: Top area x1736

### Text on the board
Top: E | a | s | R | t | a | e | d | r | i | o
bNames: 3.3V | GND | Rx | Tx
tStop: E | a | s | R | t | a | e | d | r | i | o